# Altium schematic sheet keycontrol.SchDoc
size A3
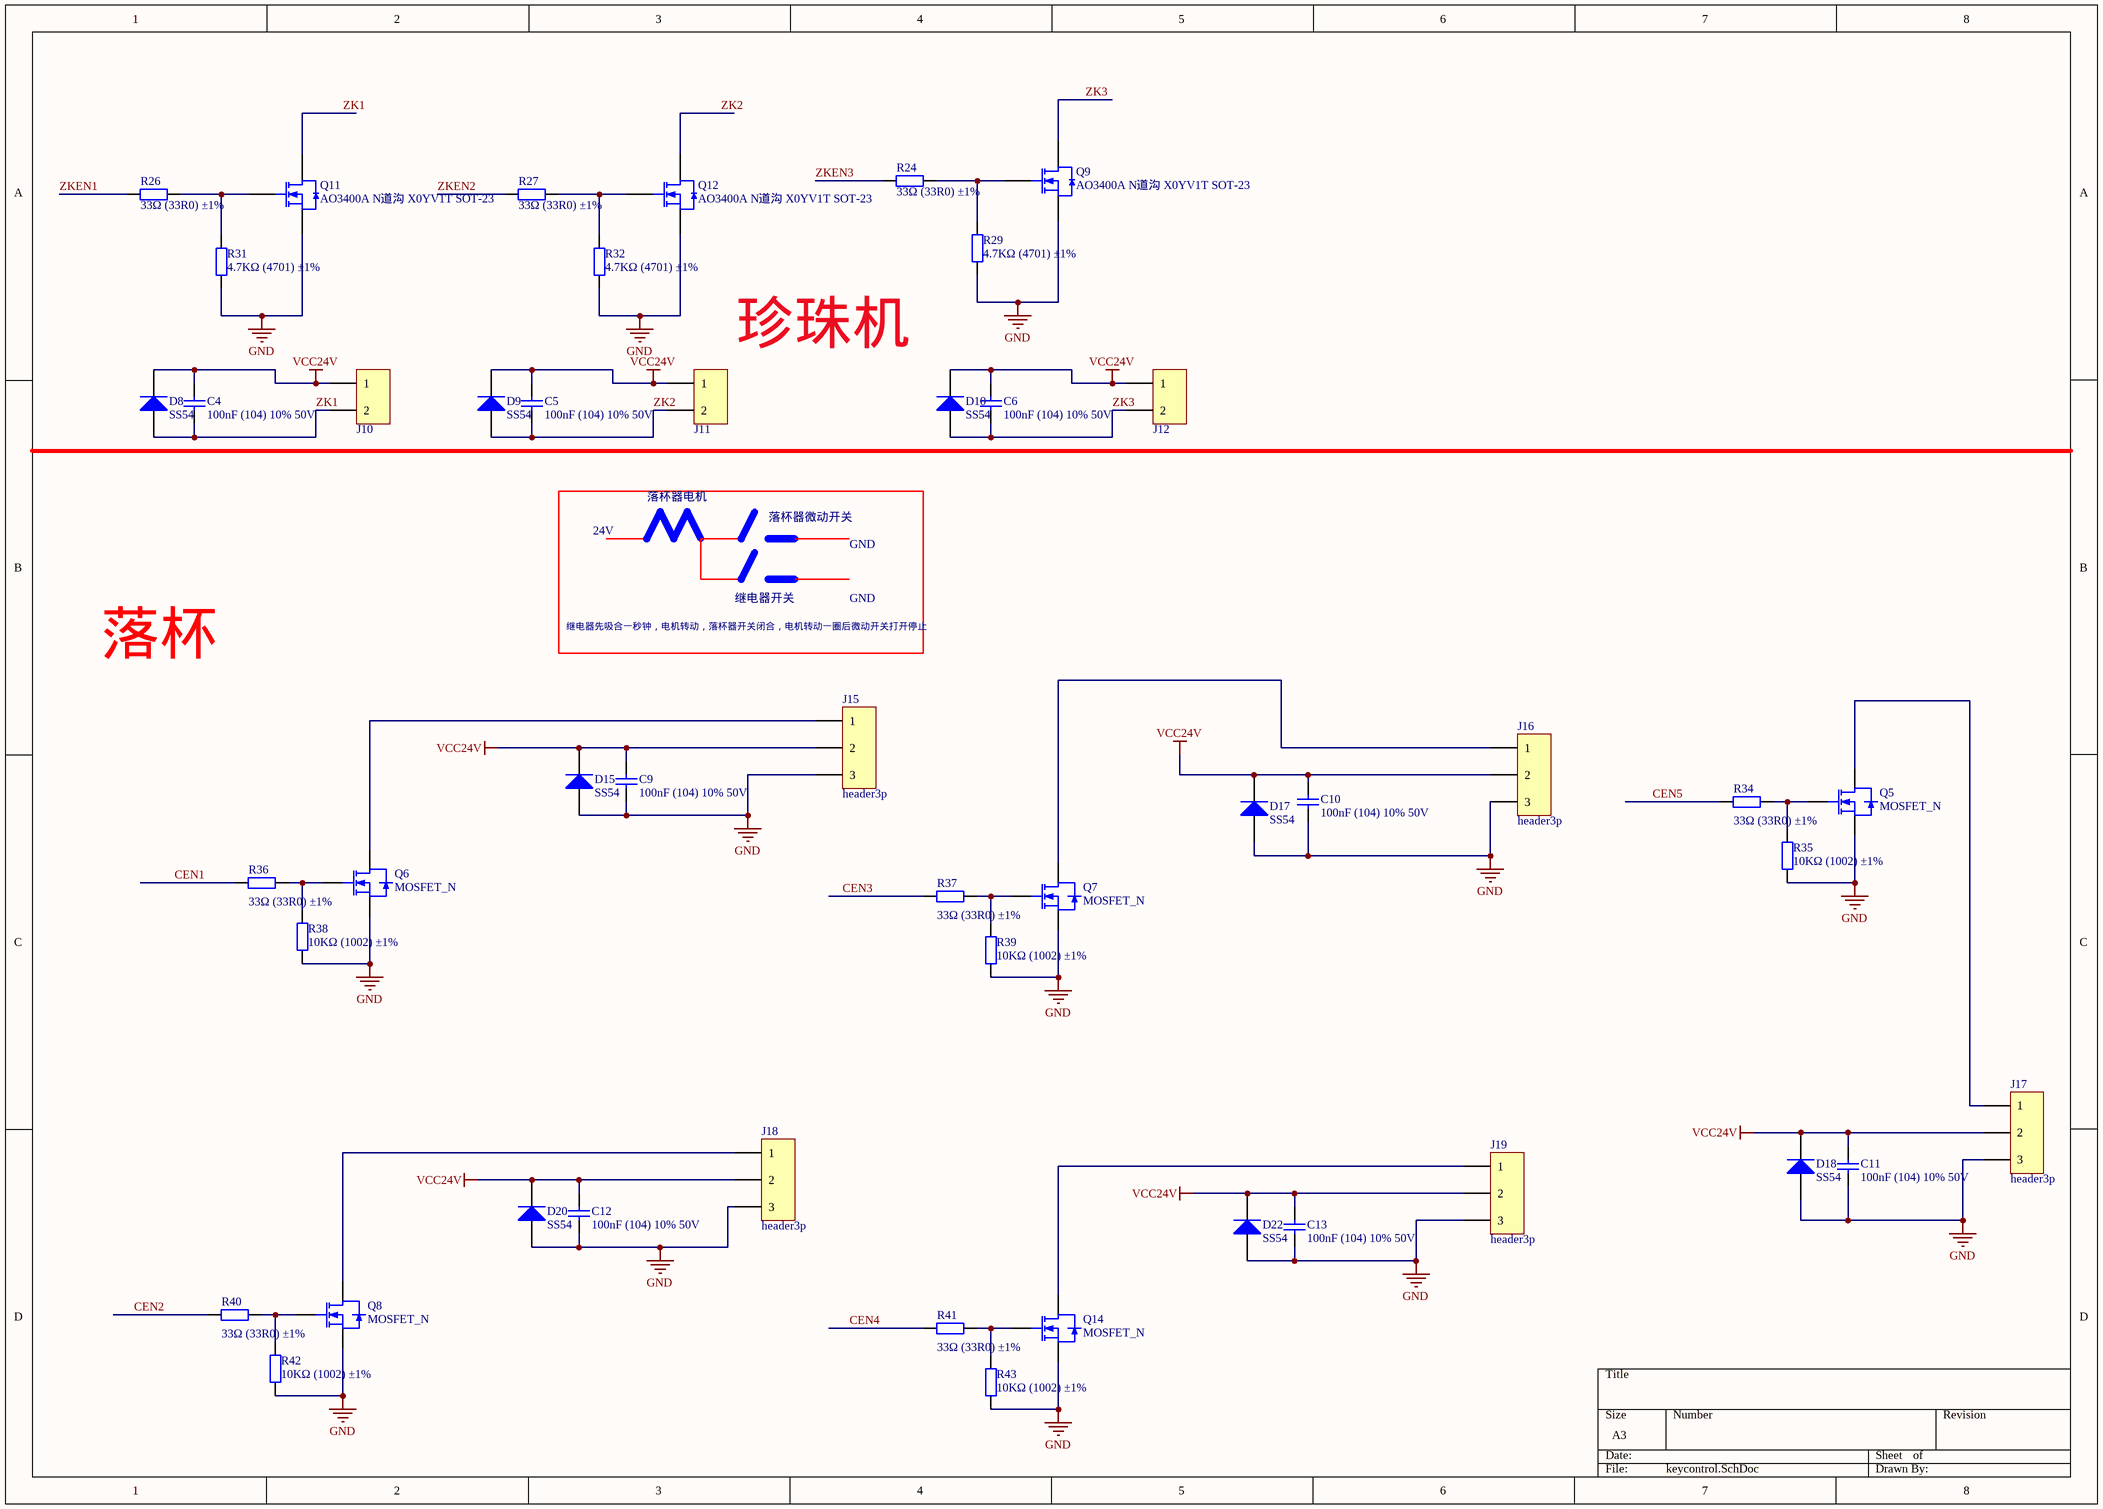
[diagram p0: keycontrol.SchDoc]

## Parts
C4  100nF (104) 10% 50V  [0603_C]
C5  100nF (104) 10% 50V  [0603_C]
C6  100nF (104) 10% 50V  [0603_C]
C9  100nF (104) 10% 50V  [0603_C]
C10  100nF (104) 10% 50V  [0603_C]
C11  100nF (104) 10% 50V  [0603_C]
C12  100nF (104) 10% 50V  [0603_C]
C13  100nF (104) 10% 50V  [0603_C]
D8  SS54  [SMA(DO-214AC)_S1]
D9  SS54  [SMA(DO-214AC)_S1]
D10  SS54  [SMA(DO-214AC)_S1]
D15  SS54  [SMA(DO-214AC)_S1]
D17  SS54  [SMA(DO-214AC)_S1]
D18  SS54  [SMA(DO-214AC)_S1]
D20  SS54  [SMA(DO-214AC)_S1]
D22  SS54  [SMA(DO-214AC)_S1]
J10  MOTOR  [XH-2P]  (value not drawn)
J11  MOTOR  [XH-2P]  (value not drawn)
J12  MOTOR  [XH-2P]  (value not drawn)
J15  header3p  [XH-3]
J16  header3p  [XH-3]
J17  header3p  [XH-3]
J18  header3p  [XH-3]
J19  header3p  [XH-3]
Q5  MOSFET_N  [TO-252-2]
Q6  MOSFET_N  [TO-252-2]
Q7  MOSFET_N  [TO-252-2]
Q8  MOSFET_N  [TO-252-2]
Q9  AO3400A N道沟 X0YV1T SOT-23  [SOT-23-3L]
Q11  AO3400A N道沟 X0YV1T SOT-23  [SOT-23-3L]
Q12  AO3400A N道沟 X0YV1T SOT-23  [SOT-23-3L]
Q14  MOSFET_N  [TO-252-2]
R24  33Ω (33R0) ±1%  [0603_R]
R26  33Ω (33R0) ±1%  [0603_R]
R27  33Ω (33R0) ±1%  [0603_R]
R29  4.7KΩ (4701) ±1%  [0603_R]
R31  4.7KΩ (4701) ±1%  [0603_R]
R32  4.7KΩ (4701) ±1%  [0603_R]
R34  33Ω (33R0) ±1%  [0603_R]
R35  10KΩ (1002) ±1%  [0603_R]
R36  33Ω (33R0) ±1%  [0603_R]
R37  33Ω (33R0) ±1%  [0603_R]
R38  10KΩ (1002) ±1%  [0603_R]
R39  10KΩ (1002) ±1%  [0603_R]
R40  33Ω (33R0) ±1%  [0603_R]
R41  33Ω (33R0) ±1%  [0603_R]
R42  10KΩ (1002) ±1%  [0603_R]
R43  10KΩ (1002) ±1%  [0603_R]

## Nets
GND: C9.1 C10.1 C11.1 C12.1 C13.1 D15.1(A) D17.1(A) D18.1(A) D20.1(A) D22.1(A) J15.3 J16.3 J17.3 J18.3 J19.3 Q5.3(S) Q6.3(S) Q7.3(S) Q8.3(S) Q9.2(S) Q11.2(S) Q12.2(S) Q14.3(S) R29.1 R31.1 R32.1 R35.1 R38.1 R39.1 R42.1 R43.1
VCC24V: C4.2 C5.2 C6.2 C9.2 C10.2 C11.2 C12.2 C13.2 D8.2(K) D9.2(K) D10.2(K) D15.2(K) D17.2(K) D18.2(K) D20.2(K) D22.2(K) J10.1 J11.1 J12.1 J15.2 J16.2 J17.2 J18.2 J19.2
CEN1: R36.1
CEN2: R40.1
CEN3: R37.1
CEN4: R41.1
CEN5: R34.1
ZK1: C4.1 D8.1(A) J10.2 Q11.3(D)
ZK2: C5.1 D9.1(A) J11.2 Q12.3(D)
ZK3: C6.1 D10.1(A) J12.2 Q9.3(D)
ZKEN1: R26.1
ZKEN2: R27.1
ZKEN3: R24.1
NetJ15_1: J15.1 Q6.2(D)
NetJ16_1: J16.1 Q7.2(D)
NetJ17_1: J17.1 Q5.2(D)
NetJ18_1: J18.1 Q8.2(D)
NetJ19_1: J19.1 Q14.2(D)
NetQ5_1: Q5.1(G) R34.2 R35.2
NetQ6_1: Q6.1(G) R36.2 R38.2
NetQ7_1: Q7.1(G) R37.2 R39.2
NetQ8_1: Q8.1(G) R40.2 R42.2
NetQ9_1: Q9.1(G) R24.2 R29.2
NetQ11_1: Q11.1(G) R26.2 R31.2
NetQ12_1: Q12.1(G) R27.2 R32.2
NetQ14_1: Q14.1(G) R41.2 R43.2

## Notes on the sheet
- 珍珠机
- 落杯器电机
- 24V
- 落杯器微动开关
- GND
- 继电器先吸合一秒钟，电机转动，落杯器开关闭合，电机转动一圈后微动开关打开停止
- 继电器开关
- 落杯

## Library data of the parts
C4-C6 C9-C13 = 0603 100nF (104) 10% 50V: 贴片电容; ComponentLink1Description: 供应商链接; ComponentLink1URL: http://www.szlcsc.com/product/details_15331.html; Package: 0603; Supplier: LC; SuppliersPartNumber: C14663
D8-D10 D15 D17 D18 D20 D22 = SMA(DO-214AC) SS54: 二极管; ComponentLink1Description: 供应商链接; ComponentLink1URL: http://www.szlcsc.com/product/details_23178.html; Package: SMA(DO-214AC); Supplier: LC; SuppliersPartNumber: C22452
J10-J12 = header2
Q9 Q11 Q12 = AO3400A N道沟 X0YV1T SOT-23: MOS(场效应管); ComponentLink1Description: 供应商链接; ComponentLink1URL: http://www.szlcsc.com/product/details_21629.html; Package: SOT-23; Supplier: LC; SuppliersPartNumber: C20917
R24 R26 R27 R34 R36 R37 R40 R41 = 0603 33Ω (33R0) 1%: 贴片电阻; ComponentLink1Description: 供应商链接; ComponentLink1URL: http://www.szlcsc.com/product/details_23867.html; Package: 0603; Supplier: LC; SuppliersPartNumber: C23140
R29 R31 R32 = 0603 4.7KΩ (4701) 1%: 贴片电阻; ComponentLink1Description: 供应商链接; ComponentLink1URL: http://www.szlcsc.com/product/details_23889.html; Package: 0603; Supplier: LC; SuppliersPartNumber: C23162
R35 R38 R39 R42 R43 = 0603 10KΩ (1002) 1%: 贴片电阻; ComponentLink1Description: 供应商链接; ComponentLink1URL: http://www.szlcsc.com/product/details_26547.html; Package: 0603; Supplier: LC; SuppliersPartNumber: C25804